# EAGLE schematic SD_w_hexconverter_ (EAGLE 6.1)
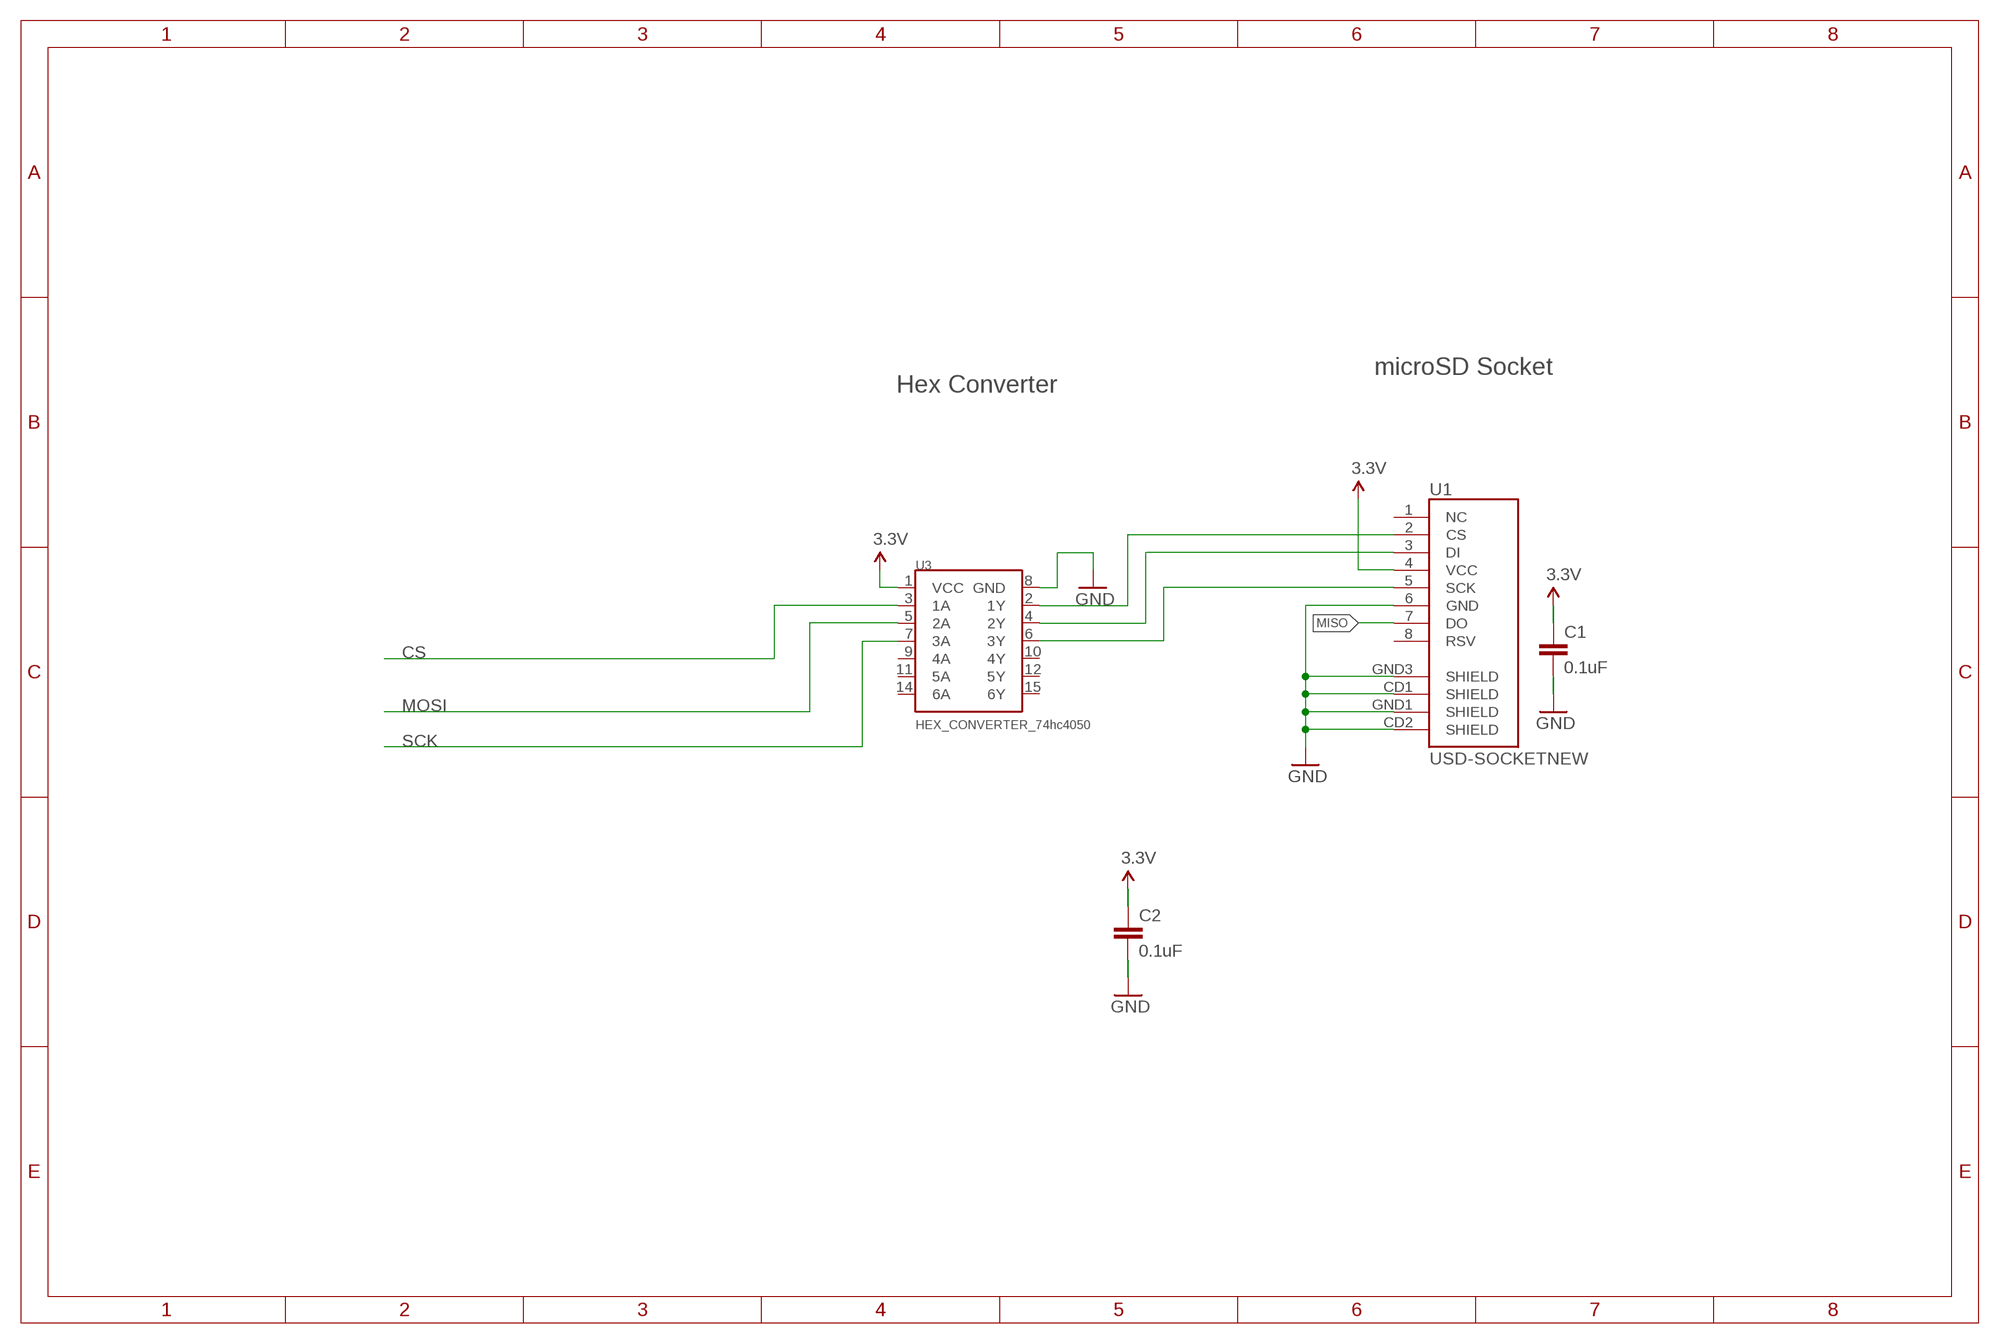
[diagram p0: schematic, sheet 1]

## Parts
C1  0.1uF  0.1UF-25V-5%(0603)  [0603-CAP]
C2  0.1uF  0.1UF-25V-5%(0603)  [0603-CAP]
U1  USD-SOCKETNEW  [MICRO-SD-SOCKET-PP]
U3  HEX_CONVERTER_74hc4050  HEX_CONVERTER  [SO016]

## Nets
3.3V: C1.1 C2.1 U1.4(VCC) U3.1(VCC)
CS: U3.3(1A)
GND: C1.2 C2.2 U1.6(GND) U1.CD1(SHIELD) U1.CD2(SHIELD) U1.GND1(SHIELD) U1.GND3(SHIELD) U3.8(GND)
MISO: U1.7(DO)
MOSI: U3.5(2A)
N$2: U1.3(DI) U3.4(2Y)
N$4: U1.5(SCK) U3.6(3Y)
N$163: U1.2(CS) U3.2(1Y)
SCK: U3.7(3A)
Unconnected: U1.1(NC) U1.8(RSV) U3.9(4A) U3.10(4Y) U3.11(5A) U3.12(5Y) U3.14(6A) U3.15(6Y)

## Notes on the sheet
- microSD Socket
- Hex Converter

## Library data of the parts
C1 C2 = SparkFun-Capacitors:0.1UF-25V-5%(0603): CAP-08604; PROD_ID: CAP-08604
U1 = SparkFun:USD-SOCKET: microSD Socket Push-push type uSD socket. Schematic element and footprint production proven. Spark Fun Electronics SKU : PRT-00127. tDoc lines correctly indicate media card edge positions when inserting (unlocked, locked, depressed).
U3 = SparkFun:HEX_CONVERTER